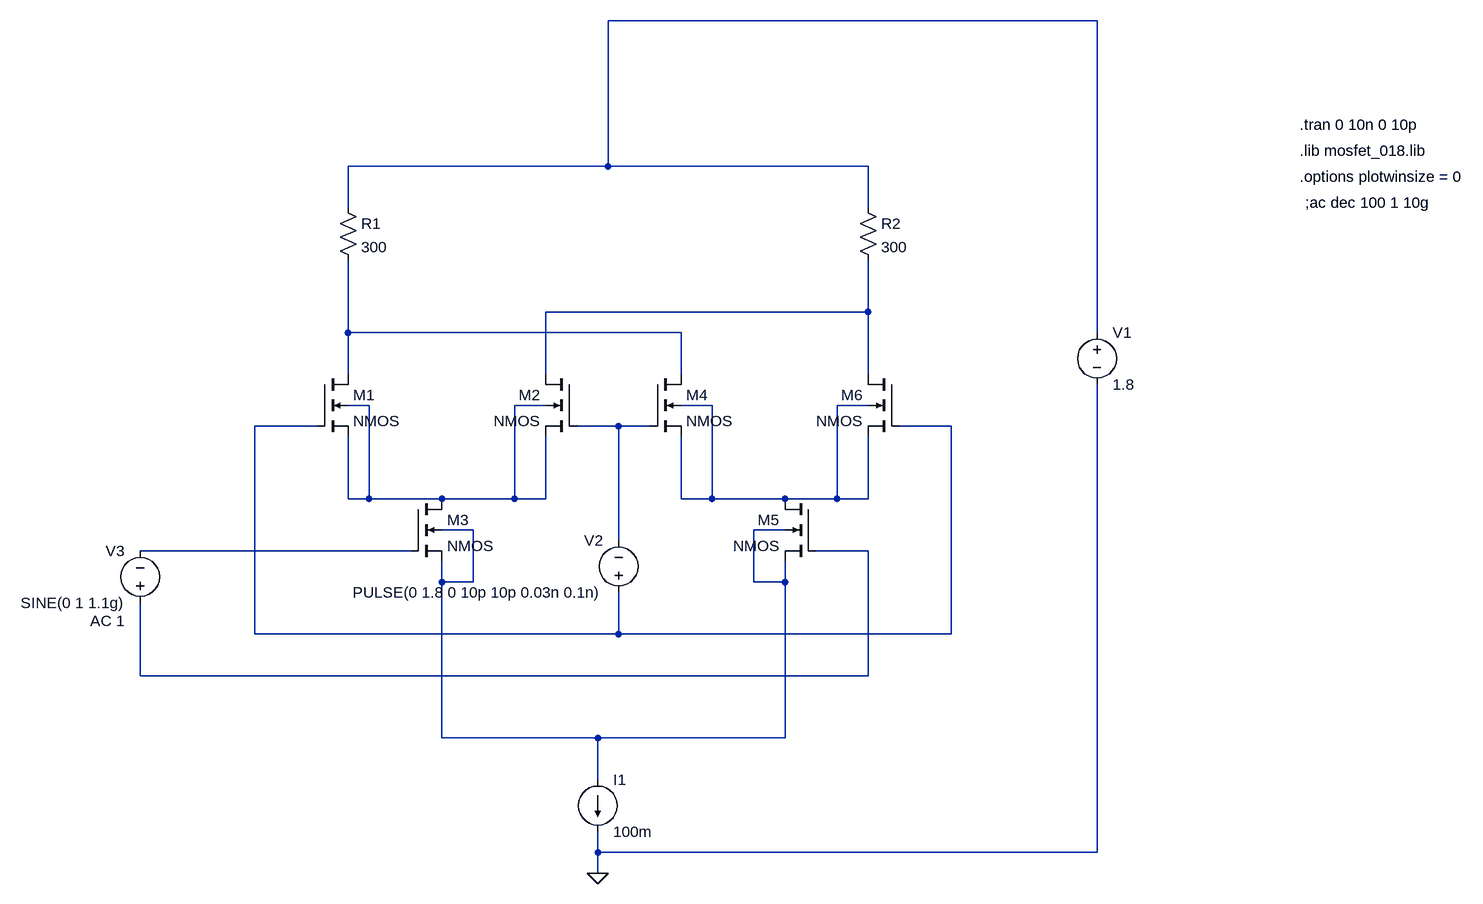
[diagram p0: schematic gilbert_cell.asc]
gilbert_cell.asc, the LTspice schematic file:
Version 4
SHEET 1 1732 680
WIRE 1136 -720 384 -720
WIRE 384 -496 384 -720
WIRE 384 -496 -16 -496
WIRE 784 -496 384 -496
WIRE -16 -432 -16 -496
WIRE 784 -432 784 -496
WIRE 784 -272 784 -352
WIRE 784 -272 288 -272
WIRE -16 -240 -16 -352
WIRE 496 -240 -16 -240
WIRE 1136 -240 1136 -720
WIRE -16 -176 -16 -240
WIRE 288 -176 288 -272
WIRE 496 -176 496 -240
WIRE 784 -176 784 -272
WIRE 16 -128 -16 -128
WIRE 288 -128 240 -128
WIRE 544 -128 496 -128
WIRE 784 -128 736 -128
WIRE -64 -96 -160 -96
WIRE 400 -96 336 -96
WIRE 448 -96 400 -96
WIRE 912 -96 832 -96
WIRE -16 16 -16 -80
WIRE 16 16 16 -128
WIRE 16 16 -16 16
WIRE 128 16 16 16
WIRE 240 16 240 -128
WIRE 240 16 128 16
WIRE 288 16 288 -80
WIRE 288 16 240 16
WIRE 496 16 496 -80
WIRE 544 16 544 -128
WIRE 544 16 496 16
WIRE 656 16 544 16
WIRE 736 16 736 -128
WIRE 736 16 656 16
WIRE 784 16 784 -80
WIRE 784 16 736 16
WIRE 176 64 128 64
WIRE 656 64 608 64
WIRE 400 80 400 -96
WIRE 80 96 -336 96
WIRE 784 96 704 96
WIRE 128 144 128 112
WIRE 176 144 176 64
WIRE 176 144 128 144
WIRE 608 144 608 64
WIRE 656 144 656 112
WIRE 656 144 608 144
WIRE -160 224 -160 -96
WIRE 400 224 400 160
WIRE 400 224 -160 224
WIRE 912 224 912 -96
WIRE 912 224 400 224
WIRE -336 288 -336 176
WIRE 784 288 784 96
WIRE 784 288 -336 288
WIRE 128 384 128 144
WIRE 368 384 128 384
WIRE 656 384 656 144
WIRE 656 384 368 384
WIRE 368 448 368 384
WIRE 368 560 368 528
WIRE 1136 560 1136 -160
WIRE 1136 560 368 560
WIRE 368 592 368 560
FLAG 368 592 0
SYMBOL nmos4 -64 -176 R0
SYMATTR InstName M1
SYMATTR Value2 l=0.18u w=6u
SYMBOL nmos4 336 -176 M0
SYMATTR InstName M2
SYMATTR Value2 l=0.18u w=6u
SYMBOL nmos4 80 16 R0
SYMATTR InstName M3
SYMATTR Value2 l=0.18u w=6u
SYMBOL nmos4 448 -176 R0
SYMATTR InstName M4
SYMATTR Value2 l=0.18u w=6u
SYMBOL nmos4 704 16 M0
SYMATTR InstName M5
SYMATTR Value2 l=0.18u w=6u
SYMBOL nmos4 832 -176 M0
SYMATTR InstName M6
SYMATTR Value2 l=0.18u w=6u
SYMBOL res -32 -448 R0
SYMATTR InstName R1
SYMATTR Value 300
SYMATTR SpiceLine tol=1 pwr=0.1
SYMBOL res 768 -448 R0
SYMATTR InstName R2
SYMATTR Value 300
SYMBOL voltage 1136 -256 R0
WINDOW 123 0 0 Left 0
WINDOW 39 0 0 Left 0
SYMATTR InstName V1
SYMATTR Value 1.8
SYMBOL voltage 400 176 R180
WINDOW 0 24 96 Left 2
WINDOW 3 24 16 Left 2
WINDOW 123 0 0 Left 0
WINDOW 39 0 0 Left 0
SYMATTR InstName V2
SYMATTR Value PULSE(0 1.8 0 10p 10p 0.03n 0.1n)
SYMBOL current 368 448 R0
WINDOW 123 0 0 Left 0
WINDOW 39 0 0 Left 0
SYMATTR InstName I1
SYMATTR Value 100m
SYMBOL voltage -336 192 R180
WINDOW 0 24 96 Left 2
WINDOW 3 24 16 Left 2
WINDOW 123 24 -12 Left 2
WINDOW 39 0 0 Left 0
SYMATTR InstName V3
SYMATTR Value SINE(0 1 1.1g)
SYMATTR Value2 AC 1
TEXT 1448 -560 Left 2 !.tran 0 10n 0 10p
TEXT 1448 -520 Left 2 !.lib mosfet_018.lib
TEXT 1448 -480 Left 2 !.options plotwinsize = 0
TEXT 1456 -440 Left 2 !;ac dec 100 1 10g

The netlist it stands for:
* gilbert_cell.asc
M1 N003 N006 N004 N004 NMOS l=0.18u w=6u
M2 N002 N007 N004 N004 NMOS l=0.18u w=6u
M3 N004 N009 N008 N008 NMOS l=0.18u w=6u
M4 N003 N007 N005 N005 NMOS l=0.18u w=6u
M5 N005 N010 N008 N008 NMOS l=0.18u w=6u
M6 N002 N006 N005 N005 NMOS l=0.18u w=6u
R1 N001 N003 300 tol=1 pwr=0.1
R2 N001 N002 300
V1 N001 0 1.8
V2 N006 N007 PULSE(0 1.8 0 10p 10p 0.03n 0.1n)
I1 N008 0 100m
V3 N010 N009 SINE(0 1 1.1g) AC 1
.model NMOS NMOS
.model PMOS PMOS
.lib standard.mos
.tran 0 10n 0 10p
.lib mosfet_018.lib
.options plotwinsize = 0
;ac dec 100 1 10g
.backanno
.end